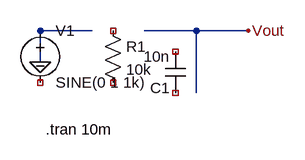
[diagram p0: schematic rc_lowpass.asc]
rc_lowpass.asc, the LTspice schematic file:
Version 4
SHEET 1 880 680
WIRE 144 112 64 112
WIRE 304 112 224 112
WIRE 384 112 304 112
WIRE 64 160 64 112
WIRE 304 208 304 112
FLAG 64 160 0
FLAG 384 112 Vout
SYMBOL voltage 64 96 R0
SYMATTR InstName V1
SYMATTR Value SINE(0 1 1k)
SYMBOL res 160 96 R0
SYMATTR InstName R1
SYMATTR Value 10k
SYMBOL cap 288 208 R180
SYMATTR InstName C1
SYMATTR Value 10n
TEXT 72 264 Left 2 !.tran 10m

The netlist it stands for:
* rc_lowpass.asc
V1 0 NC_01 SINE(0 1 1k)
R1 NC_02 NC_03 10k
C1 NC_04 NC_05 10n
.tran 10m
.backanno
.end